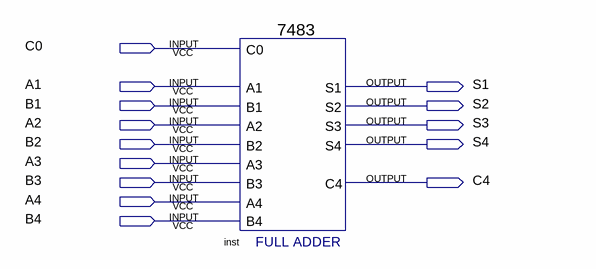
[diagram p0: schematic sheet]
// Quartus schematic shao1.bdf as structural Verilog: 1 symbols, 14 pins
module shao1 (
  input  C0,
  input  A1,
  input  B1,
  input  A2,
  input  B2,
  input  A3,
  input  B3,
  input  A4,
  input  B4,
  output S1,
  output S2,
  output S3,
  output S4,
  output C4
);

  \7483  inst (
    .B4(B4), .C0(C0), .A1(A1), .A2(A2), .B1(B1), .B2(B2), .A3(A3), .B3(B3), .A4(A4), .S3(S3), .S4(S4),
    .S2(S2), .C4(C4), .S1(S1));
endmodule
